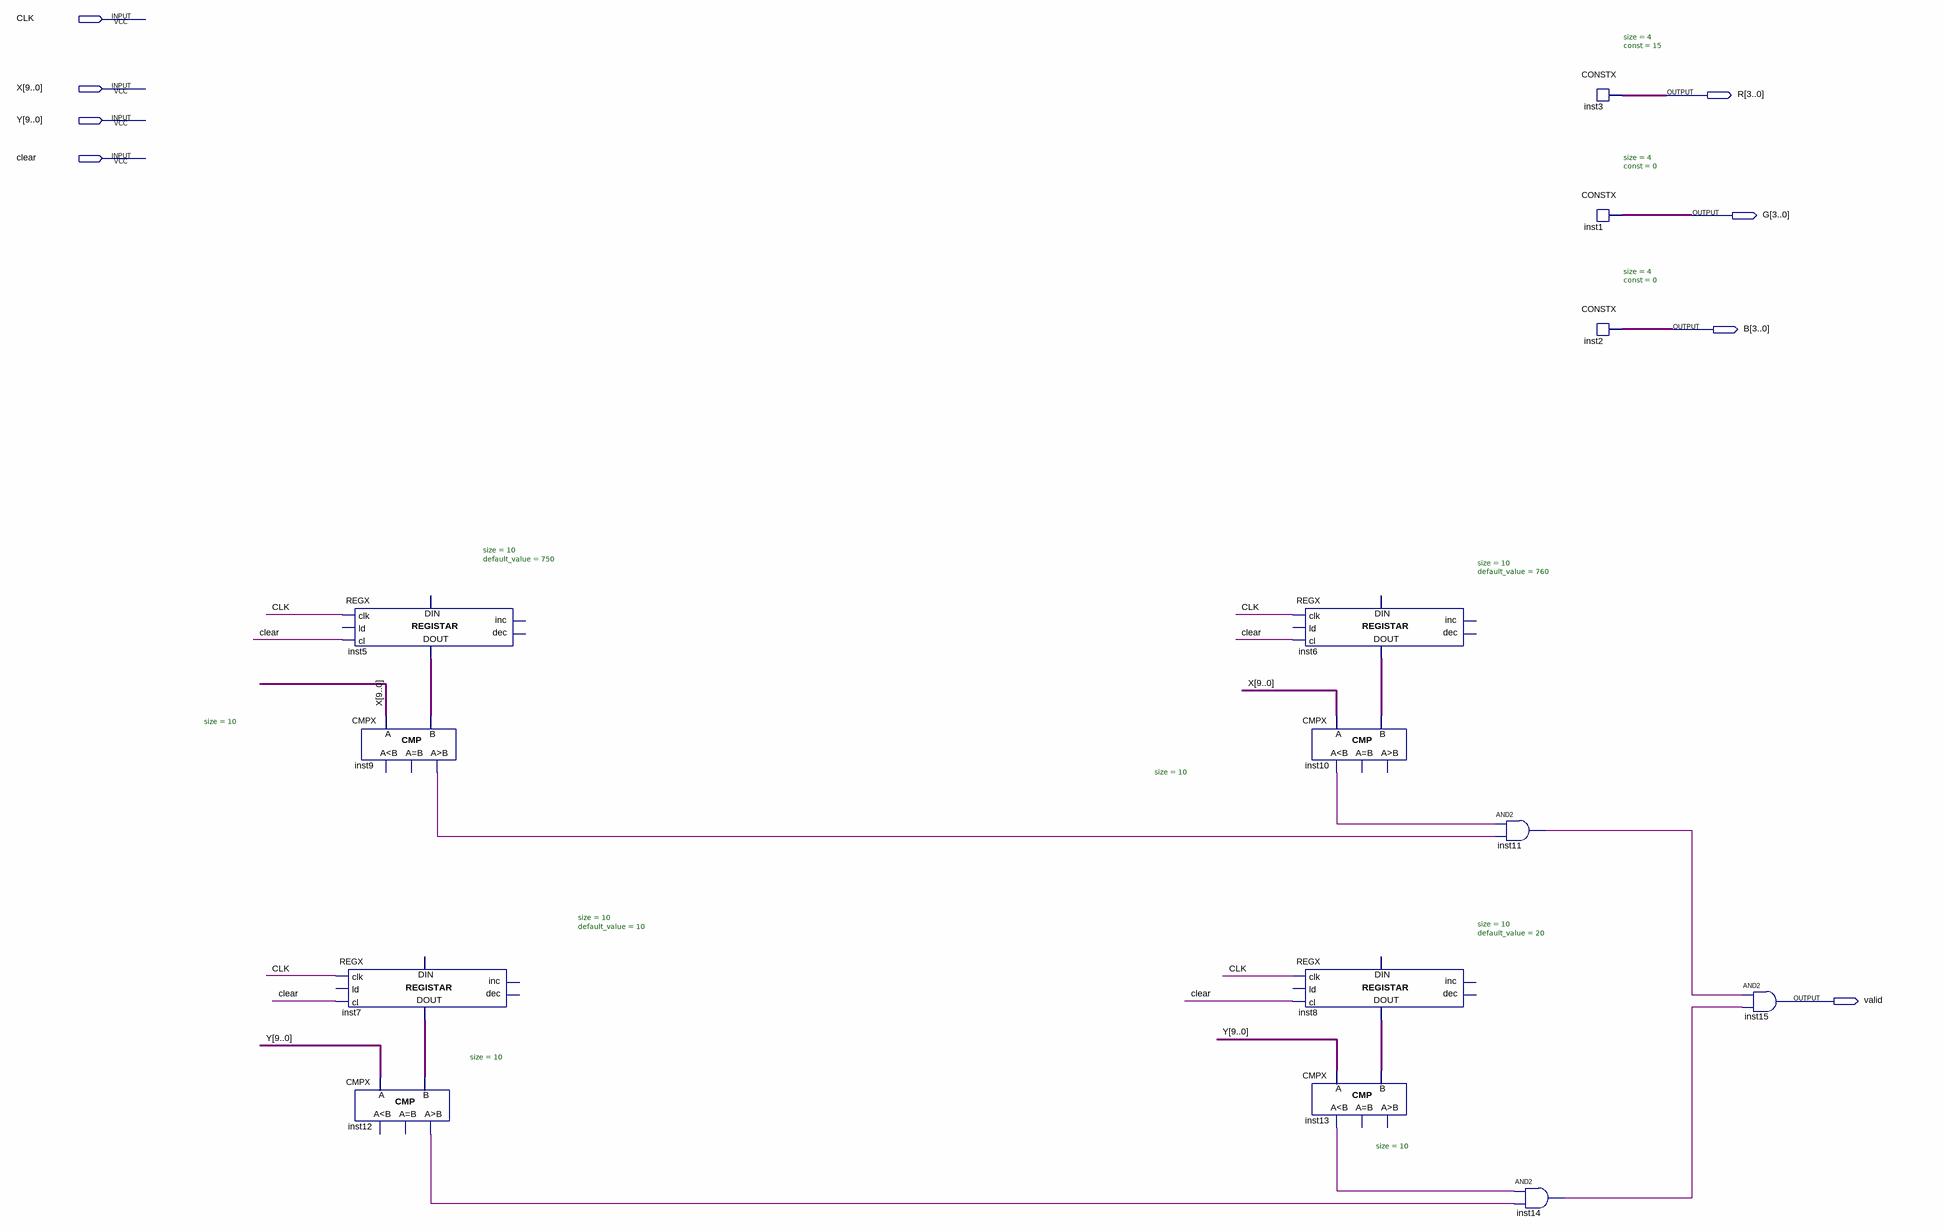
[diagram p0: schematic sheet]
// Quartus schematic PrviZivot.bdf as structural Verilog: 14 symbols, 8 pins
module PrviZivot (
  input  CLK,
  input  [9:0] X,
  input  [9:0] Y,
  input  clear,
  output [3:0] R,
  output [3:0] G,
  output [3:0] B,
  output valid
);

  wire inst9_gr, inst10_ls, inst11_out, inst12_gr, inst13_ls, inst14_out;
  wire [9:0] inst5_data_out, inst6_data_out, inst7_data_out, inst8_data_out;

  REGX #(.size(10), .default_value(750)) inst5 (
    .clk(CLK), .cl(clear), .data_out(inst5_data_out));  // open: ld, inc, dec, data_in
  CMPX #(.size(10)) inst9 (.A(X), .B(inst5_data_out), .gr(inst9_gr));  // open: ls, eq
  REGX #(.size(10), .default_value(10)) inst7 (
    .clk(CLK), .cl(clear), .data_out(inst7_data_out));  // open: ld, inc, dec, data_in
  CMPX #(.size(10)) inst12 (.A(Y), .B(inst7_data_out), .gr(inst12_gr));  // open: ls, eq
  REGX #(.size(10), .default_value(760)) inst6 (
    .clk(CLK), .cl(clear), .data_out(inst6_data_out));  // open: ld, inc, dec, data_in
  CMPX #(.size(10)) inst10 (.A(X), .B(inst6_data_out), .ls(inst10_ls));  // open: eq, gr
  REGX #(.size(10), .default_value(20)) inst8 (
    .clk(CLK), .cl(clear), .data_out(inst8_data_out));  // open: ld, inc, dec, data_in
  CMPX #(.size(10)) inst13 (.A(Y), .B(inst8_data_out), .ls(inst13_ls));  // open: eq, gr
  and inst11 (inst11_out, inst10_ls, inst9_gr);
  and inst14 (inst14_out, inst13_ls, inst12_gr);
  CONSTX #(.size(4), .\const (15)) inst3 (.data(R));
  CONSTX #(.size(4), .\const (0)) inst1 (.data(G));
  CONSTX #(.size(4), .\const (0)) inst2 (.data(B));
  and inst15 (valid, inst11_out, inst14_out);
endmodule
